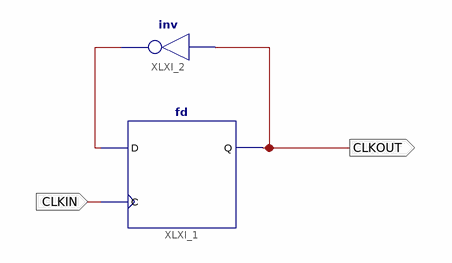
[diagram p0: schematic sheet 1]
// Xilinx ISE schematic Divider.sch (spartan6) as structural Verilog: 2 symbols, 2 ports
module Divider (
  input  CLKIN,
  output CLKOUT
);

  wire XLXN_2;

  fd XLXI_1 (.C(CLKIN), .D(XLXN_2), .Q(CLKOUT));
  not XLXI_2 (XLXN_2, CLKOUT);
endmodule
